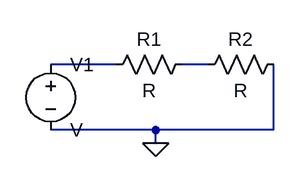
[diagram p0: schematic p3 reihen.asc]
p3 reihen.asc, the LTspice schematic file:
Version 4
SHEET 1 880 680
WIRE 112 112 32 112
WIRE 224 112 192 112
WIRE 160 192 32 192
WIRE 304 192 304 112
WIRE 304 192 160 192
WIRE 160 208 160 192
FLAG 160 208 0
SYMBOL voltage 32 96 R0
SYMATTR InstName V1
SYMBOL res 208 96 R90
WINDOW 0 0 56 VBottom 2
WINDOW 3 32 56 VTop 2
SYMATTR InstName R1
SYMBOL res 320 96 R90
WINDOW 0 0 56 VBottom 2
WINDOW 3 32 56 VTop 2
SYMATTR InstName R2

The netlist it stands for:
* p3 reihen.asc
V1 N001 0 V
R1 N002 N001 R
R2 0 N002 R
.backanno
.end